# Altium schematic sheet FPGA_51_Ethernet_Ping_E_MAC.SchDoc
size B; Organization: Altium Limited; Address1: L3, 12a Rodborough Rd; Address2: Frenchs Forest; Address3: NSW; Address4: Australia 2086; DocumentNumber: 1; SheetNumber: 1; SheetTotal: 1
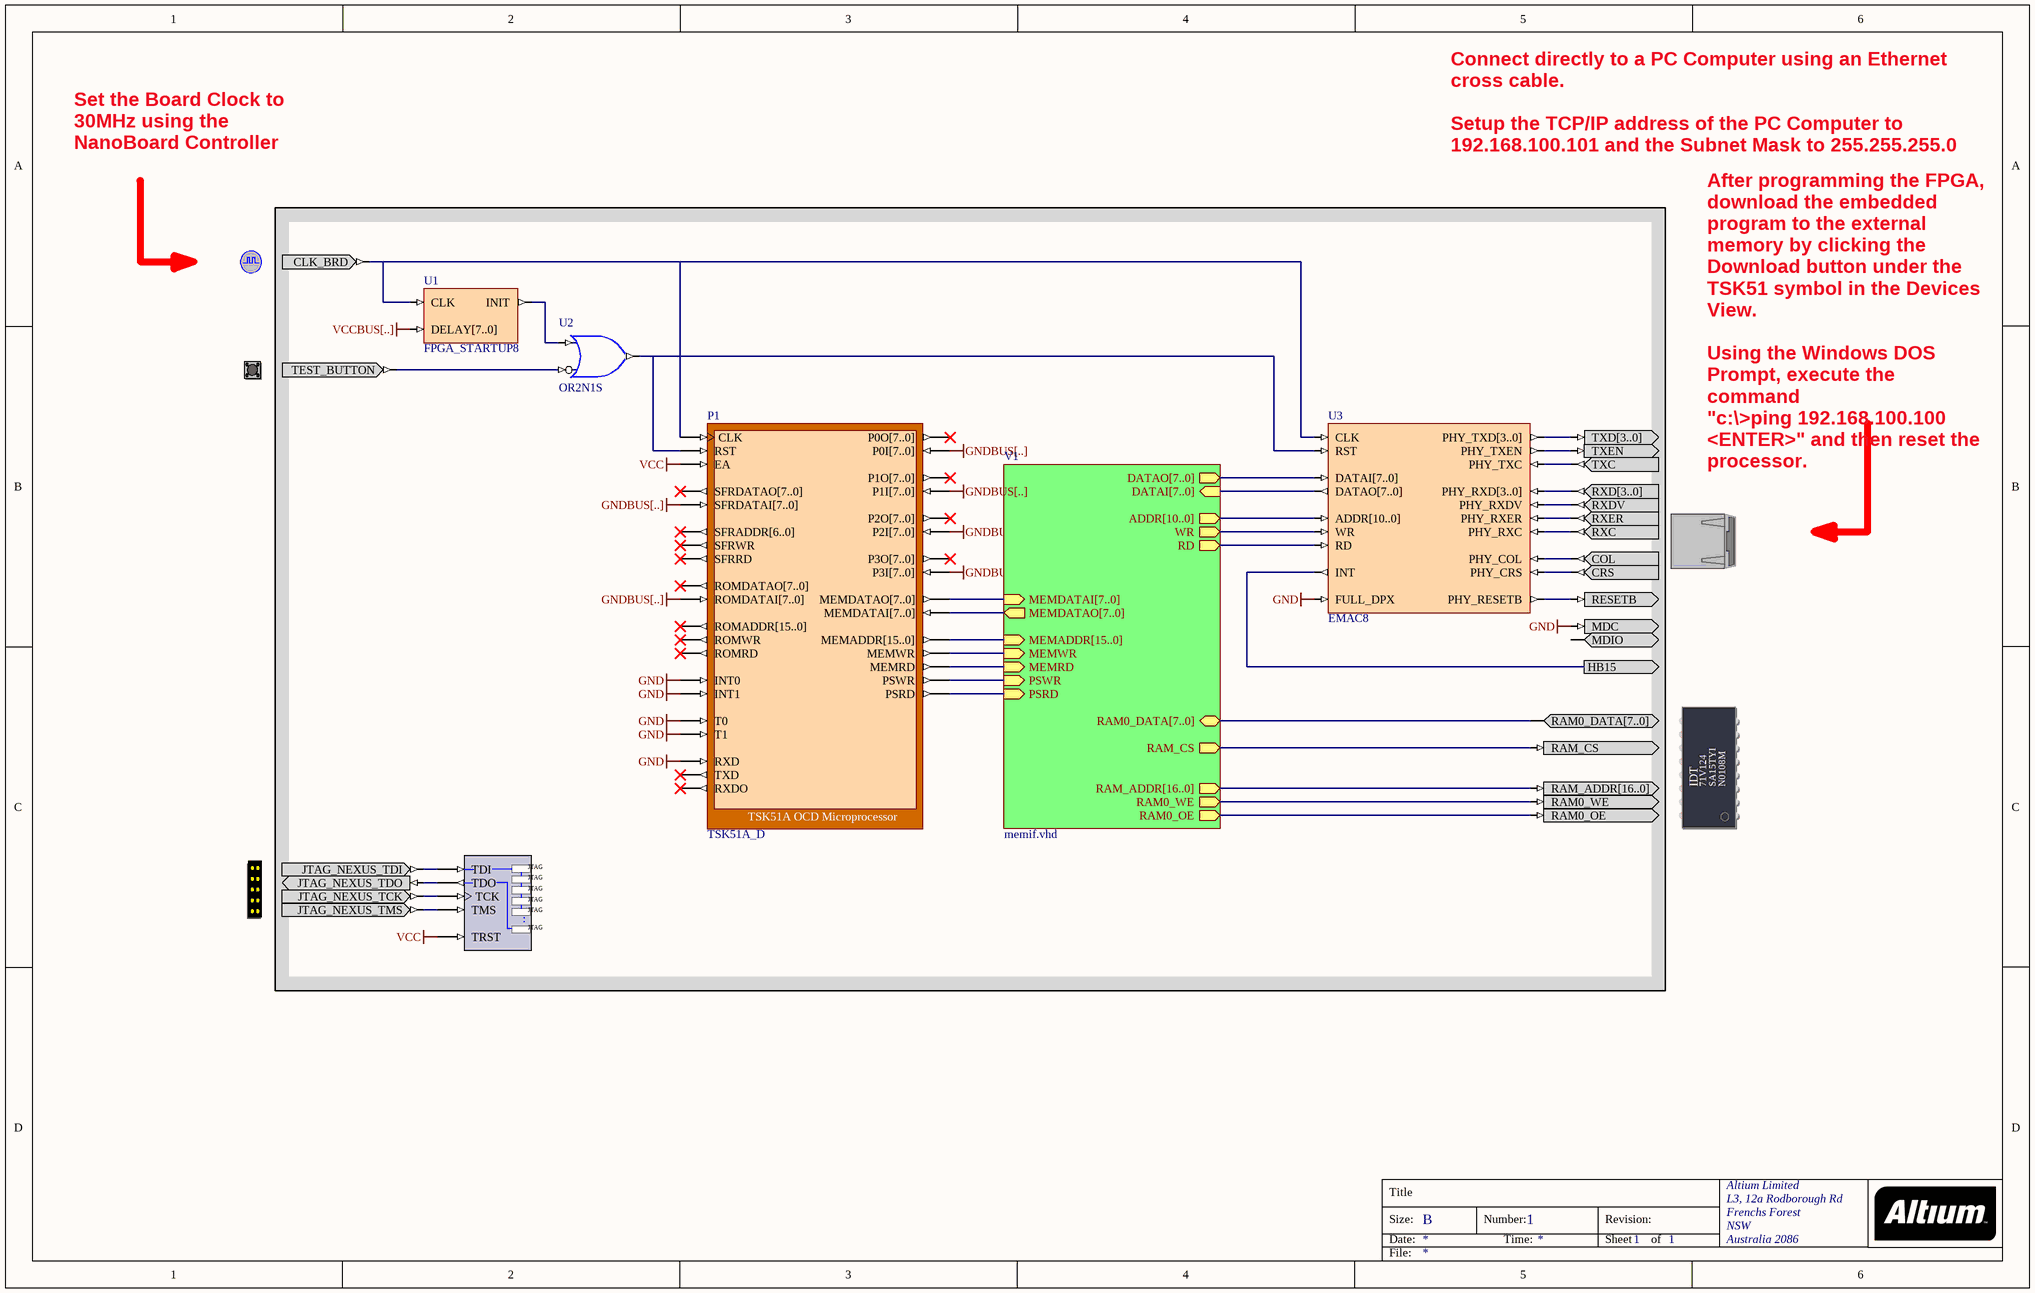
[diagram p0: FPGA_51_Ethernet_Ping_E_MAC.SchDoc]

## Parts
(Parts that share a designator on the sheet are numbered #1, #2 ... from top to bottom, then left to right.)
?#1  CLOCK_BOARD  (value not drawn)
?#2  TEST_BUTTON  (value not drawn)
?#3  ETH_PHY  (value not drawn)
?#4  MEMORY0  (value not drawn)
?#5  NEXUS_JTAG_CONNECTOR  (value not drawn)
NEXUS_JTAG_PORT  NEXUS_JTAG_PORT  (value not drawn)
P1  TSK51A_D
U1  FPGA_STARTUP8
U2  OR2N1S
U3  EMAC8

## Sub-sheets
V1 = memif.vhd: MEMDATAI[7..0] (in), MEMDATAO[7..0] (out), MEMADDR[15..0] (in), MEMWR (in), MEMRD (in), PSWR (in), PSRD (in), DATAO[7..0] (out), DATAI[7..0] (in), ADDR[10..0] (out), WR (out), RD (out), RAM0_DATA[7..0] (bidir), RAM_CS (out), RAM_ADDR[16..0] (out), RAM0_WE (out), RAM0_OE (out)

## Ports
HB15 (out)

## Nets
GND: ?#3.MDC P1.INT0 P1.INT1 P1.RXD P1.T0 P1.T1 U3.FULL_DPX
GNDBUS[..]: P1.P0I[7..0] P1.P1I[7..0] P1.P2I[7..0] P1.P3I[7..0] P1.ROMDATAI[7..0] P1.SFRDATAI[7..0]
VCC: NEXUS_JTAG_PORT.TRST P1.EA
VCCBUS[..]: U1.DELAY[7..0]
HB15: U3.INT ; port HB15
Net?#1_CLK_BRD: ?#1.CLK_BRD P1.CLK U1.CLK U3.CLK
Net?#2_TEST_BUTTON: ?#2.TEST_BUTTON U2.I0
Net?#3_COL: ?#3.COL U3.PHY_COL
Net?#3_CRS: ?#3.CRS U3.PHY_CRS
Net?#3_RESETB: ?#3.RESETB U3.PHY_RESETB
Net?#3_RXC: ?#3.RXC U3.PHY_RXC
Net?#3_RXD[3..0]: ?#3.RXD[3..0] U3.PHY_RXD[3..0]
Net?#3_RXDV: ?#3.RXDV U3.PHY_RXDV
Net?#3_RXER: ?#3.RXER U3.PHY_RXER
Net?#3_TXC: ?#3.TXC U3.PHY_TXC
Net?#3_TXD[3..0]: ?#3.TXD[3..0] U3.PHY_TXD[3..0]
Net?#3_TXEN: ?#3.TXEN U3.PHY_TXEN
Net?#4_RAM0_DATA[7..0]: ?#4.RAM0_DATA[7..0] ; sheet V1/RAM0_DATA[7..0]
Net?#4_RAM0_OE: ?#4.RAM0_OE ; sheet V1/RAM0_OE
Net?#4_RAM0_WE: ?#4.RAM0_WE ; sheet V1/RAM0_WE
Net?#4_RAM_ADDR[16..0]: ?#4.RAM_ADDR[16..0] ; sheet V1/RAM_ADDR[16..0]
Net?#4_RAM_CS: ?#4.RAM_CS ; sheet V1/RAM_CS
Net?#5_JTAG_NEXUS_TCK: ?#5.JTAG_NEXUS_TCK NEXUS_JTAG_PORT.TCK
Net?#5_JTAG_NEXUS_TDI: ?#5.JTAG_NEXUS_TDI NEXUS_JTAG_PORT.TDI
Net?#5_JTAG_NEXUS_TDO: ?#5.JTAG_NEXUS_TDO NEXUS_JTAG_PORT.TDO
Net?#5_JTAG_NEXUS_TMS: ?#5.JTAG_NEXUS_TMS NEXUS_JTAG_PORT.TMS
NetP1_MEMADDR[15..0]: P1.MEMADDR[15..0] ; sheet V1/MEMADDR[15..0]
NetP1_MEMDATAI[7..0]: P1.MEMDATAI[7..0] ; sheet V1/MEMDATAO[7..0]
NetP1_MEMDATAO[7..0]: P1.MEMDATAO[7..0] ; sheet V1/MEMDATAI[7..0]
NetP1_MEMRD: P1.MEMRD ; sheet V1/MEMRD
NetP1_MEMWR: P1.MEMWR ; sheet V1/MEMWR
NetP1_PSRD: P1.PSRD ; sheet V1/PSRD
NetP1_PSWR: P1.PSWR ; sheet V1/PSWR
NetP1_RST: P1.RST U2.O U3.RST
NetU1_INIT: U1.INIT U2.I1
NetU3_ADDR[10..0]: U3.ADDR[10..0] ; sheet V1/ADDR[10..0]
NetU3_DATAI[7..0]: U3.DATAI[7..0] ; sheet V1/DATAO[7..0]
NetU3_DATAO[7..0]: U3.DATAO[7..0] ; sheet V1/DATAI[7..0]
NetU3_RD: U3.RD ; sheet V1/RD
NetU3_WR: U3.WR ; sheet V1/WR

Not connected (* = marked no-connect by the designer): ?#3 MDIO; P1 P0O[7..0]* P1O[7..0]* P2O[7..0]* P3O[7..0]* ROMADDR[15..0]* ROMDATAO[7..0]* ROMRD* ROMWR* RXDO* SFRADDR[6..0]* SFRDATAO[7..0]* SFRRD* SFRWR* TXD*

## Notes on the sheet
- Set the Board Clock to 30MHz using the NanoBoard Controller
- Connect directly to a PC Computer using an Ethernet cross cable.
  Setup the TCP/IP address of the PC Computer to 192.168.100.101 and the Subnet Mask to 255.255.255.0
- After programming the FPGA, download the embedded program to the external memory by clicking the Download button under the TSK51 symbol in the Devices View.
  Using the Windows DOS Prompt, execute the command
  "c:\>ping 192.168.100.100 <ENTER>" and then reset the processor.
- Title
- Size:
- Date:
- B
- Number:
- Time:
- Revision:
- Sheet
- of
- File:
- (in symbol MEMORY0) IDT; 71V124; SA15TYI; N0108M
- (in symbol NEXUS_JTAG_PORT) JTAG; .

## Library data of the parts
?#1 = CLOCK_BOARD: Global System Clock Supply; PortComponent: True; Published: 19-Nov-2003; Publisher: Altium Limited
?#2 = TEST_BUTTON: Test Button; PortComponent: True; Published: 19-Nov-2003; Publisher: Altium Limited
?#3 = ETH_PHY: Ethernet PHY-interface; PortComponent: True; Published: 19-Nov-2003; Publisher: Altium Limited
?#4 = MEMORY0: SRAM - 0 Module; PortComponent: True; Published: 19-Nov-2003; Publisher: Altium Limited
?#5 = NEXUS_JTAG_CONNECTOR: JTAG Port; PortComponent: True; Published: 19-Nov-2003; Publisher: Altium Limited
NEXUS_JTAG_PORT = NEXUS_JTAG_PORT: Soft Nexus-Chain Connector; NEXUS_JTAG_CONNECTOR: True; VHDLIB_SIM: GENERIC_LIB; Published: 29-Jan-2004; Publisher: Altium Limited
P1 = TSK51A_D: TSK51A OCD Microprocessor; NEXUS_CORE: Processor_OCDS; NEXUS_JTAG_DEVICE: True; NEXUS_JTAG_ORDER: 0; ChildModel1: RAM256x8_TSK51D; ChildCore1: M1; Published: 18/12/2003; Publisher: Altium Hobart Technology Centre; Core Revision: 1.00.00
U1 = FPGA_STARTUP8: FPGA Startup With 8 Bit Delay; Published: 21/01/2004; Publisher: Altium Hobart Technology Centre; Core Revision: 1.00.00
U2 = OR2N1S: 2-Input OR Gate with Active Low A Input, Single Pin Version; Xilinx Equivalent: OR2B1; ArchiveName: GENERIC; Published: 18-Dec-2003; Publisher: Altium Limited; Core Revision: 1.00.00
U3 = EMAC8: Ethernet Controller; ChildModel1: Memory_M1_EMAC; ChildModel2: Memory_M2_EMAC; Published: 11-May-2005; Publisher: Altium Limited; ComponentLink1Description: Core &Resource Usage; ComponentLink1URL: CR0139 FPGA Peripheral Resource Usage.pdf#page=5; HelpURL: CR0122 EMACx Controller.pdf; LastRevisionNo: 1.00.00